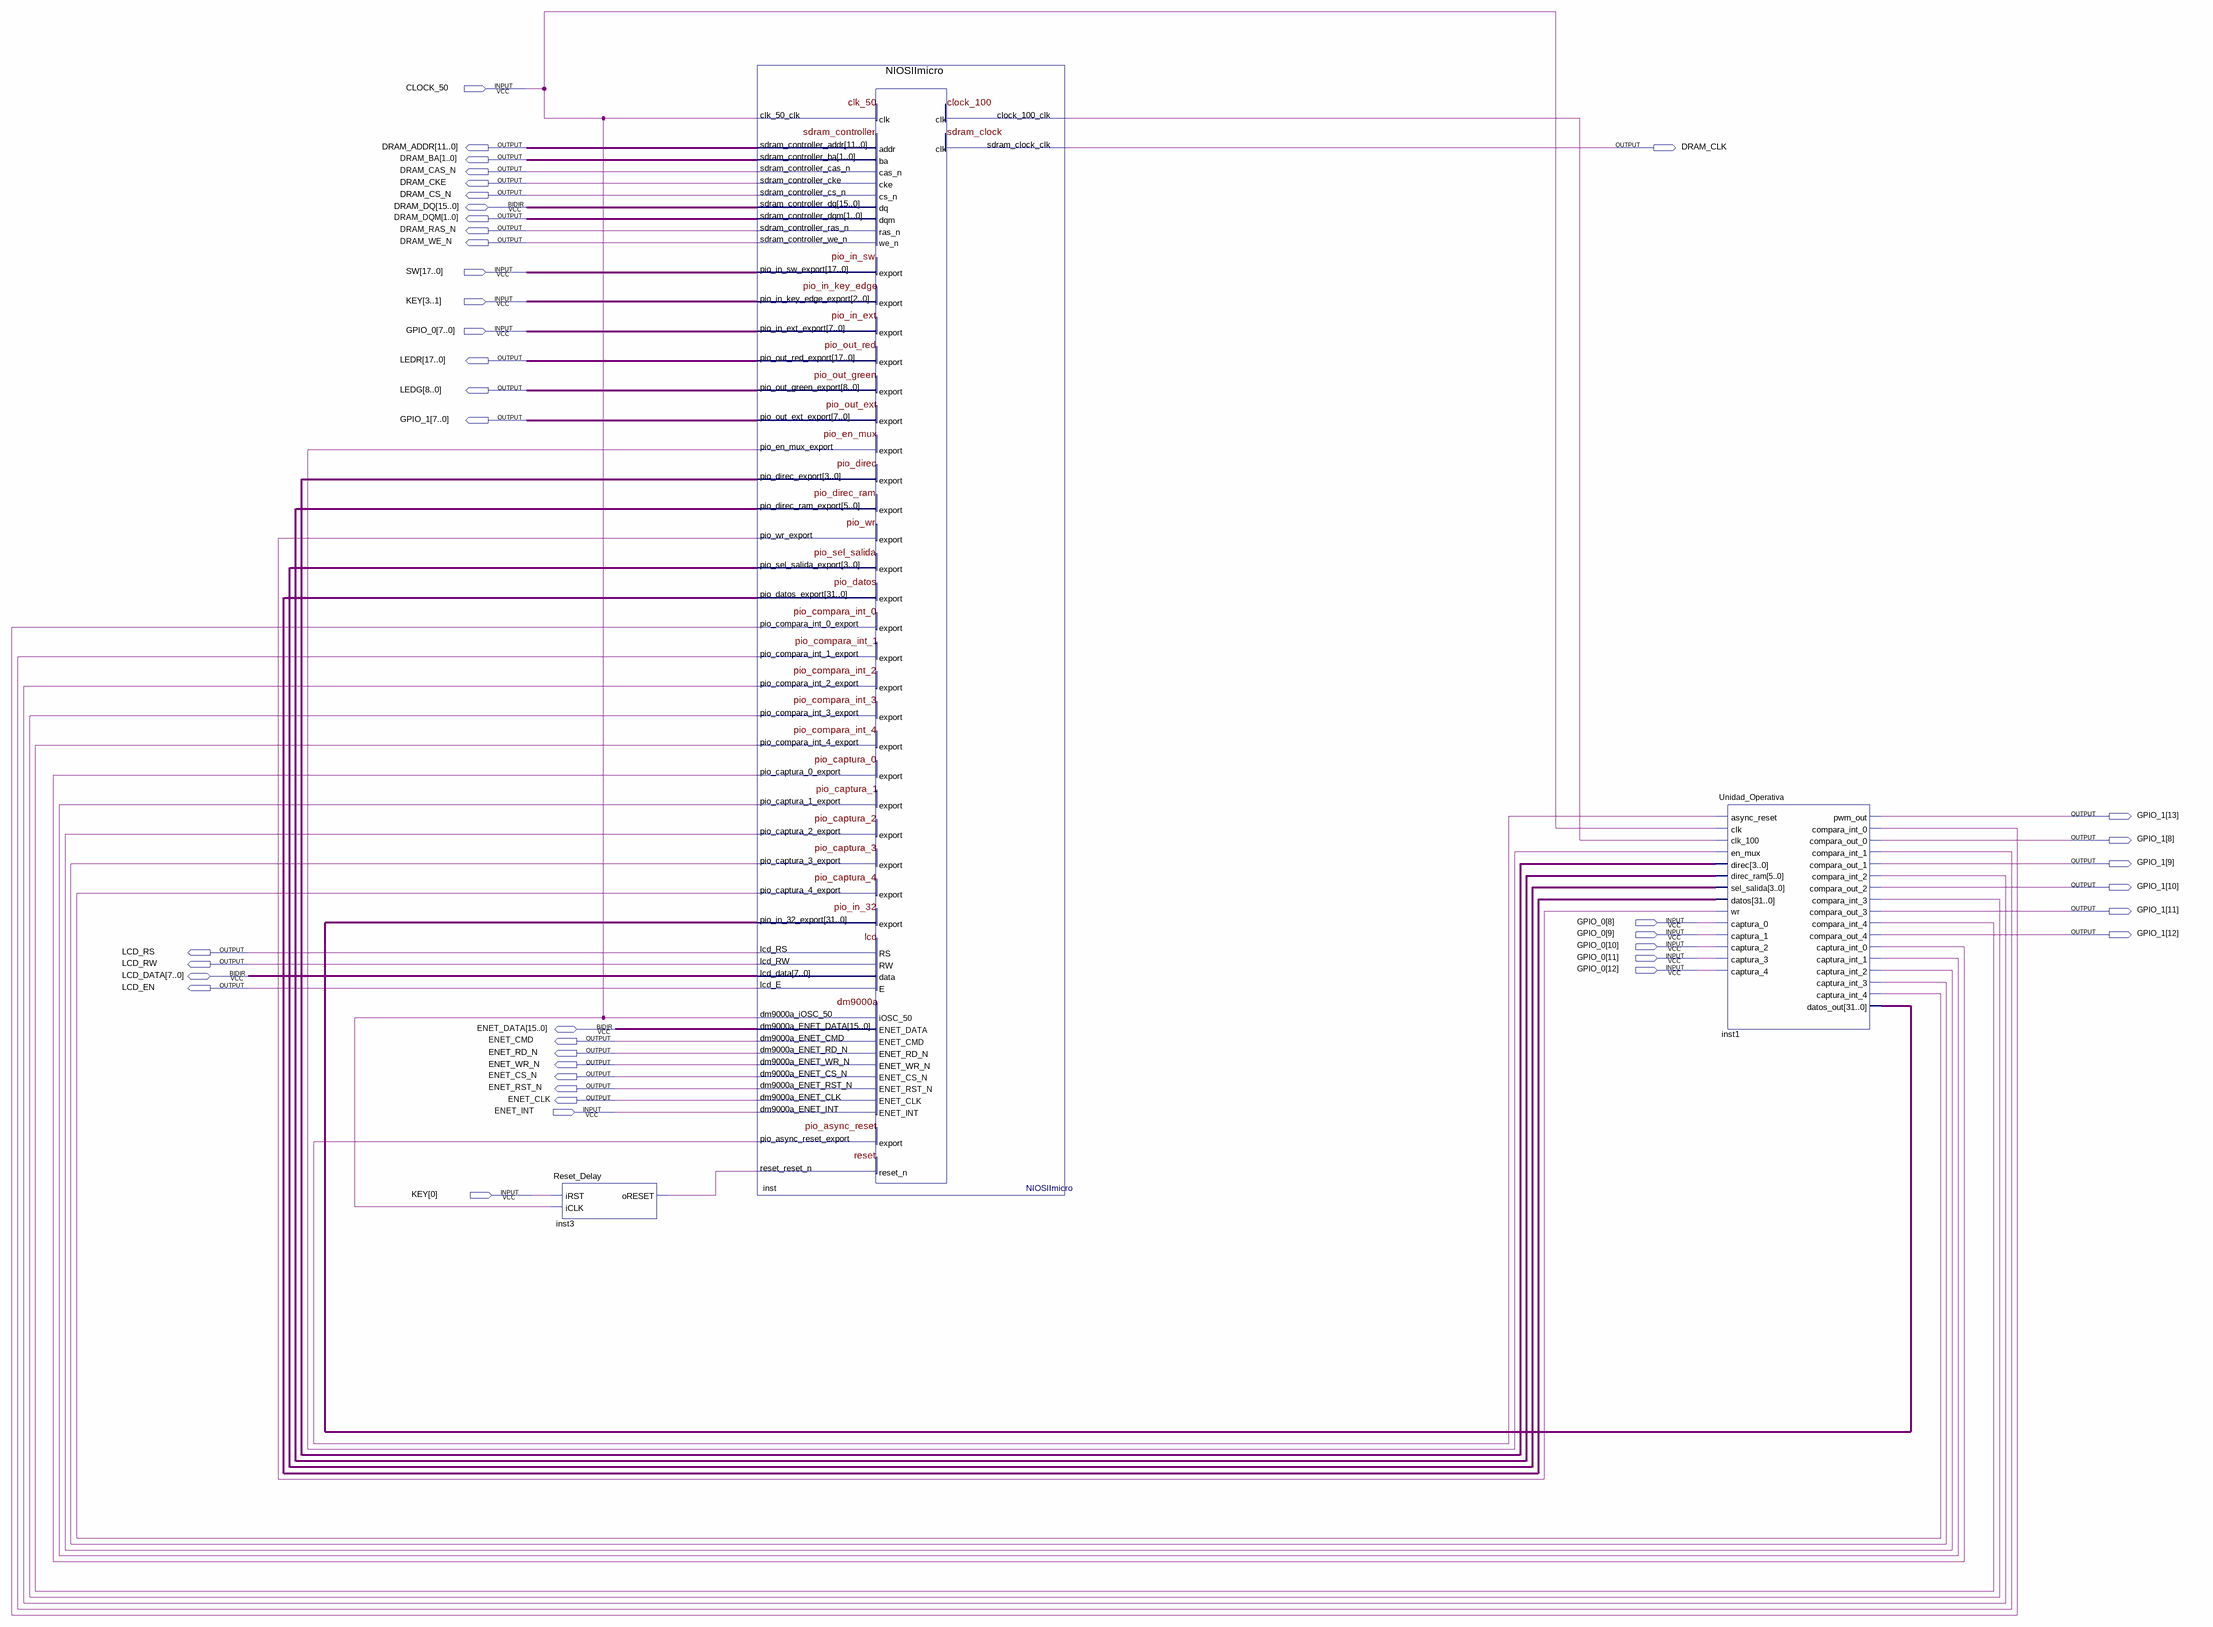
[diagram p0: schematic sheet]
// Quartus schematic NIOSIIproject.bdf as structural Verilog: 3 symbols, 41 pins
module NIOSIIproject (
  input  CLOCK_50,
  input  [17:0] SW,
  input  [3:0] KEY,
  input  [12:0] GPIO_0,
  input  ENET_INT,
  inout  [15:0] DRAM_DQ,
  inout  [7:0] LCD_DATA,
  inout  [15:0] ENET_DATA,
  output [11:0] DRAM_ADDR,
  output DRAM_CLK,
  output [1:0] DRAM_BA,
  output DRAM_CAS_N,
  output DRAM_CKE,
  output DRAM_CS_N,
  output [1:0] DRAM_DQM,
  output DRAM_RAS_N,
  output DRAM_WE_N,
  output [17:0] LEDR,
  output [8:0] LEDG,
  output [13:0] GPIO_1,
  output LCD_RS,
  output LCD_RW,
  output LCD_EN,
  output ENET_CMD,
  output ENET_RD_N,
  output ENET_WR_N,
  output ENET_CS_N,
  output ENET_RST_N,
  output ENET_CLK
);

  wire inst1_captura_int_0, inst1_captura_int_1, inst1_captura_int_2, inst1_captura_int_3,
       inst1_captura_int_4, inst1_compara_int_0, inst1_compara_int_1, inst1_compara_int_2,
       inst1_compara_int_3, inst1_compara_int_4, inst3_oreset, inst_clock_100_clk,
       inst_pio_async_reset_export, inst_pio_en_mux_export, inst_pio_wr_export;
  wire [3:0] inst_pio_direc_export, inst_pio_sel_salida_export;
  wire [5:0] inst_pio_direc_ram_export;
  wire [31:0] inst1_datos_out, inst_pio_datos_export;

  Reset_Delay inst3 (.iRST(KEY[0]), .iCLK(CLOCK_50), .oRESET(inst3_oreset));
  NIOSIImicro inst (
    .clk_50_clk(CLOCK_50), .pio_in_sw_export(SW), .pio_in_key_edge_export(KEY[3:1]),
    .pio_in_ext_export(GPIO_0[7:0]), .pio_compara_int_0_export(inst1_compara_int_0),
    .pio_compara_int_1_export(inst1_compara_int_1), .pio_compara_int_2_export(inst1_compara_int_2),
    .pio_compara_int_3_export(inst1_compara_int_3), .pio_compara_int_4_export(inst1_compara_int_4),
    .pio_captura_0_export(inst1_captura_int_0), .pio_captura_1_export(inst1_captura_int_1),
    .pio_captura_2_export(inst1_captura_int_2), .pio_captura_3_export(inst1_captura_int_3),
    .pio_captura_4_export(inst1_captura_int_4), .pio_in_32_export(inst1_datos_out),
    .dm9000a_iOSC_50(CLOCK_50), .dm9000a_ENET_INT(ENET_INT), .reset_reset_n(inst3_oreset),
    .sdram_controller_addr(DRAM_ADDR), .sdram_controller_ba(DRAM_BA), .sdram_controller_cas_n(DRAM_CAS_N),
    .sdram_controller_cke(DRAM_CKE), .sdram_controller_cs_n(DRAM_CS_N), .sdram_controller_dqm(DRAM_DQM),
    .sdram_controller_ras_n(DRAM_RAS_N), .sdram_controller_we_n(DRAM_WE_N), .pio_out_red_export(LEDR),
    .pio_out_green_export(LEDG), .pio_out_ext_export(GPIO_1[7:0]),
    .pio_en_mux_export(inst_pio_en_mux_export), .pio_direc_export(inst_pio_direc_export),
    .pio_direc_ram_export(inst_pio_direc_ram_export), .pio_wr_export(inst_pio_wr_export),
    .pio_sel_salida_export(inst_pio_sel_salida_export), .pio_datos_export(inst_pio_datos_export),
    .lcd_RS(LCD_RS), .lcd_RW(LCD_RW), .lcd_E(LCD_EN), .dm9000a_ENET_CMD(ENET_CMD),
    .dm9000a_ENET_RD_N(ENET_RD_N), .dm9000a_ENET_WR_N(ENET_WR_N), .dm9000a_ENET_CS_N(ENET_CS_N),
    .dm9000a_ENET_RST_N(ENET_RST_N), .dm9000a_ENET_CLK(ENET_CLK),
    .pio_async_reset_export(inst_pio_async_reset_export), .clock_100_clk(inst_clock_100_clk),
    .sdram_clock_clk(DRAM_CLK), .sdram_controller_dq(DRAM_DQ), .lcd_data(LCD_DATA),
    .dm9000a_ENET_DATA(ENET_DATA));
  Unidad_Operativa inst1 (
    .async_reset(inst_pio_async_reset_export), .clk(CLOCK_50), .clk_100(inst_clock_100_clk),
    .en_mux(inst_pio_en_mux_export), .direc(inst_pio_direc_export), .direc_ram(inst_pio_direc_ram_export),
    .sel_salida(inst_pio_sel_salida_export), .datos(inst_pio_datos_export), .wr(inst_pio_wr_export),
    .captura_0(GPIO_0[8]), .captura_1(GPIO_0[9]), .captura_2(GPIO_0[10]), .captura_3(GPIO_0[11]),
    .captura_4(GPIO_0[12]), .pwm_out(GPIO_1[13]), .compara_int_0(inst1_compara_int_0),
    .compara_out_0(GPIO_1[8]), .compara_int_1(inst1_compara_int_1), .compara_out_1(GPIO_1[9]),
    .compara_int_2(inst1_compara_int_2), .compara_out_2(GPIO_1[10]), .compara_int_3(inst1_compara_int_3),
    .compara_out_3(GPIO_1[11]), .compara_int_4(inst1_compara_int_4), .compara_out_4(GPIO_1[12]),
    .captura_int_0(inst1_captura_int_0), .captura_int_1(inst1_captura_int_1),
    .captura_int_2(inst1_captura_int_2), .captura_int_3(inst1_captura_int_3),
    .captura_int_4(inst1_captura_int_4), .datos_out(inst1_datos_out));
endmodule
